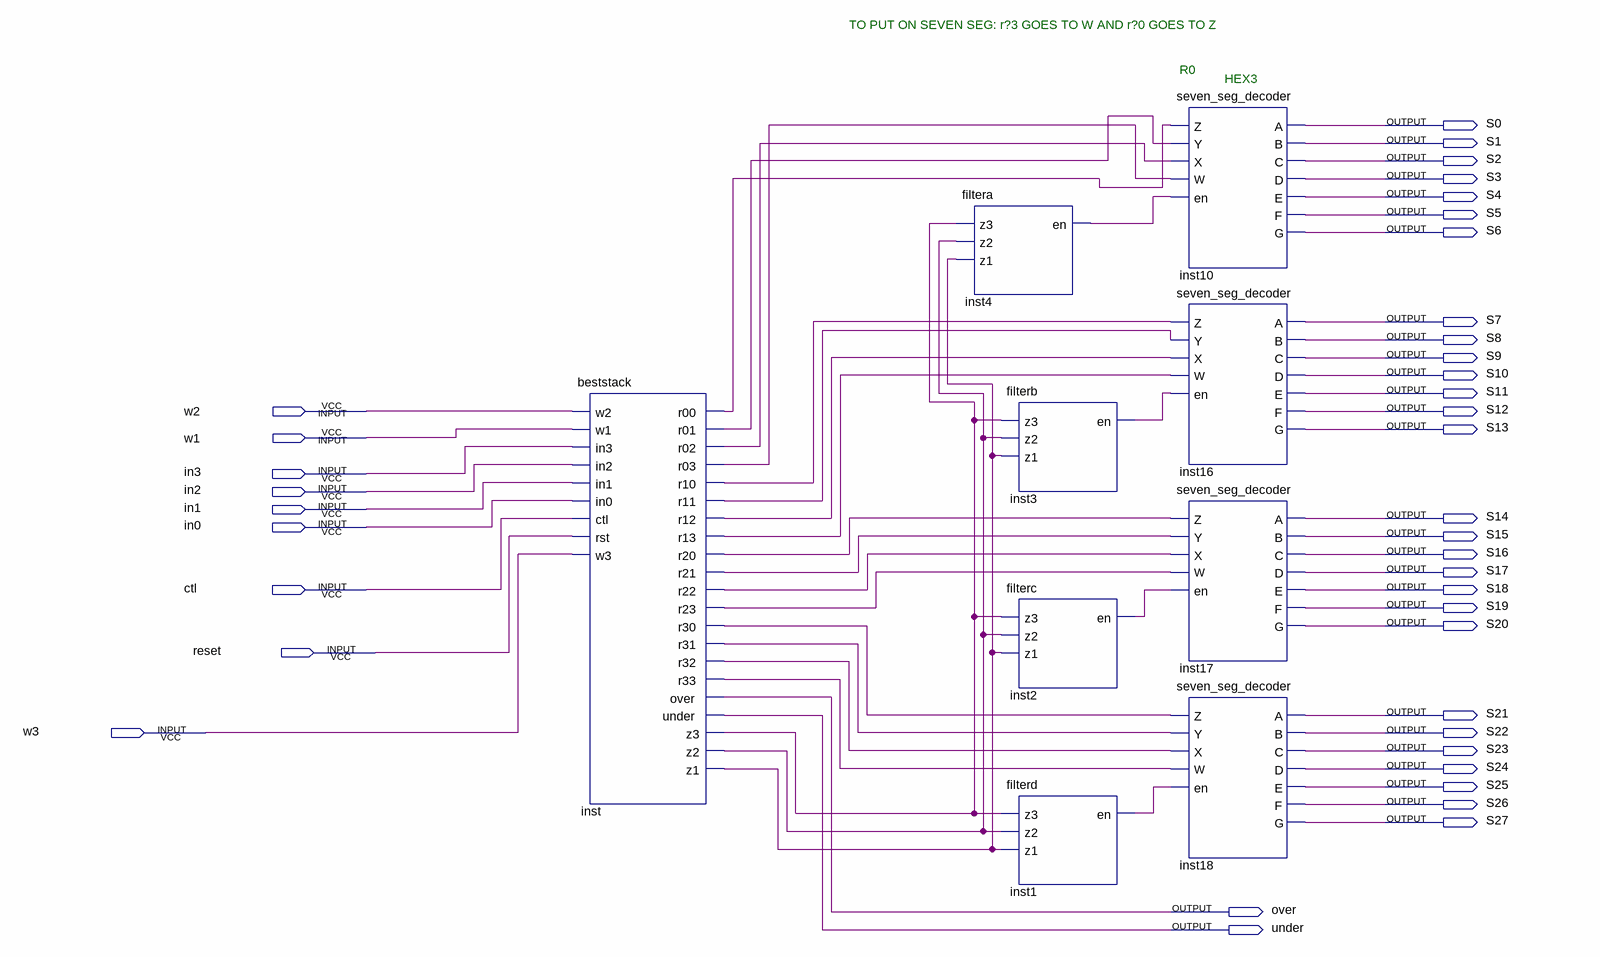
[diagram p0: schematic sheet]
// Quartus schematic finalProj.bdf as structural Verilog: 9 symbols, 39 pins
module finalProj (
  input  w2,
  input  w1,
  input  in3,
  input  in2,
  input  in1,
  input  in0,
  input  ctl,
  input  reset,
  input  w3,
  output S0,
  output S1,
  output S2,
  output S3,
  output S4,
  output S5,
  output S6,
  output S7,
  output S8,
  output S9,
  output S10,
  output S11,
  output S12,
  output S13,
  output S14,
  output S15,
  output S16,
  output S17,
  output S18,
  output S19,
  output S20,
  output S21,
  output S22,
  output S23,
  output S24,
  output S25,
  output S26,
  output S27,
  output over,
  output under
);

  wire inst1_en, inst2_en, inst3_en, inst4_en, inst_r00, inst_r01, inst_r02, inst_r03, inst_r10, inst_r11,
       inst_r12, inst_r13, inst_r20, inst_r21, inst_r22, inst_r23, inst_r30, inst_r31, inst_r32, inst_r33,
       inst_z1, inst_z2, inst_z3;

  beststack inst (
    .w2(w2), .w1(w1), .in3(in3), .in2(in2), .in1(in1), .in0(in0), .ctl(ctl), .rst(reset), .w3(w3),
    .r00(inst_r00), .r01(inst_r01), .r02(inst_r02), .r03(inst_r03), .r10(inst_r10), .r11(inst_r11),
    .r12(inst_r12), .r13(inst_r13), .r20(inst_r20), .r21(inst_r21), .r22(inst_r22), .r23(inst_r23),
    .r30(inst_r30), .r31(inst_r31), .r32(inst_r32), .r33(inst_r33), .over(over), .under(under), .z3(inst_z3),
    .z2(inst_z2), .z1(inst_z1));
  filtera inst4 (.z3(inst_z3), .z2(inst_z2), .z1(inst_z1), .en(inst4_en));
  filterb inst3 (.z3(inst_z3), .z2(inst_z2), .z1(inst_z1), .en(inst3_en));
  filterc inst2 (.z3(inst_z3), .z2(inst_z2), .z1(inst_z1), .en(inst2_en));
  filterd inst1 (.z3(inst_z3), .z2(inst_z2), .z1(inst_z1), .en(inst1_en));
  seven_seg_decoder inst10 (
    .Z(inst_r00), .Y(inst_r01), .X(inst_r02), .W(inst_r03), .en(inst4_en), .A(S0), .B(S1), .C(S2), .D(S3),
    .E(S4), .F(S5), .G(S6));
  seven_seg_decoder inst16 (
    .Z(inst_r10), .Y(inst_r11), .X(inst_r12), .W(inst_r13), .en(inst3_en), .A(S7), .B(S8), .C(S9), .D(S10),
    .E(S11), .F(S12), .G(S13));
  seven_seg_decoder inst17 (
    .Z(inst_r20), .Y(inst_r21), .X(inst_r22), .W(inst_r23), .en(inst2_en), .A(S14), .B(S15), .C(S16),
    .D(S17), .E(S18), .F(S19), .G(S20));
  seven_seg_decoder inst18 (
    .Z(inst_r30), .Y(inst_r31), .X(inst_r32), .W(inst_r33), .en(inst1_en), .A(S21), .B(S22), .C(S23),
    .D(S24), .E(S25), .F(S26), .G(S27));

  // Notes on the sheet:
  //   TO PUT ON SEVEN SEG: r?3 GOES TO W AND r?0 GOES TO Z
  //   R0
  //   HEX3
endmodule
